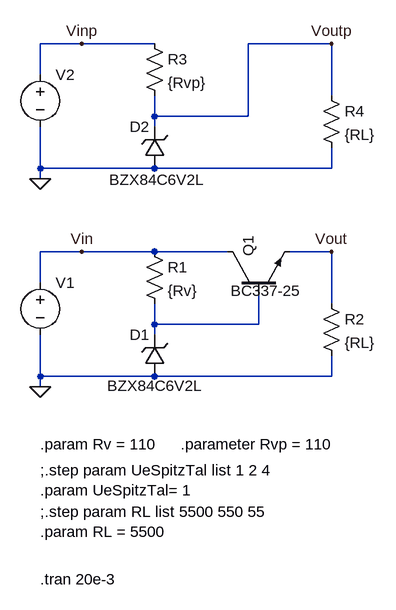
[diagram p0: schematic 400_SpgRegelung.asc]
400_SpgRegelung.asc, the LTspice schematic file:
Version 4.1
SHEET 1 968 680
WIRE 80 -304 16 -304
WIRE 192 -304 80 -304
WIRE 464 -304 336 -304
WIRE 16 -256 16 -304
WIRE 464 -224 464 -304
WIRE 192 -192 192 -224
WIRE 336 -192 336 -304
WIRE 336 -192 192 -192
WIRE 192 -176 192 -192
WIRE 16 -112 16 -176
WIRE 192 -112 16 -112
WIRE 464 -112 464 -144
WIRE 464 -112 192 -112
WIRE 16 -96 16 -112
WIRE 80 16 16 16
WIRE 192 16 80 16
WIRE 304 16 192 16
WIRE 464 16 400 16
WIRE 16 64 16 16
WIRE 464 96 464 16
WIRE 192 128 192 96
WIRE 352 128 352 80
WIRE 352 128 192 128
WIRE 192 144 192 128
WIRE 16 208 16 144
WIRE 192 208 16 208
WIRE 464 208 464 176
WIRE 464 208 192 208
WIRE 16 224 16 208
FLAG 16 224 0
FLAG 80 16 Vin
FLAG 464 16 Vout
FLAG 16 -96 0
FLAG 80 -304 Vinp
FLAG 464 -304 Voutp
SYMBOL voltage 16 48 R0
WINDOW 3 -42 -28 Invisible 2
WINDOW 123 0 0 Left 0
WINDOW 39 0 0 Left 0
SYMATTR Value SINE(12 {UeSpitzTal} 50)
SYMATTR InstName V1
SYMBOL res 176 0 R0
SYMATTR InstName R1
SYMATTR Value {Rv}
SYMBOL zener 208 208 R180
WINDOW 0 24 64 Left 2
WINDOW 3 -58 -14 Left 2
SYMATTR InstName D1
SYMATTR Value BZX84C6V2L
SYMATTR Description Diode
SYMATTR Type diode
SYMBOL npn 304 80 R270
WINDOW 3 4 5 VRight 2
SYMATTR InstName Q1
SYMATTR Value BC337-25
SYMBOL res 448 80 R0
SYMATTR InstName R2
SYMATTR Value {RL}
SYMBOL voltage 16 -272 R0
WINDOW 3 -42 -28 Invisible 2
WINDOW 123 0 0 Left 0
WINDOW 39 0 0 Left 0
SYMATTR Value SINE(12 {UeSpitzTal/2} 50)
SYMATTR InstName V2
SYMBOL res 176 -320 R0
SYMATTR InstName R3
SYMATTR Value {Rvp}
SYMBOL zener 208 -112 R180
WINDOW 0 24 64 Left 2
WINDOW 3 -61 -17 Left 2
SYMATTR InstName D2
SYMATTR Value BZX84C6V2L
SYMATTR Description Diode
SYMATTR Type diode
SYMBOL res 448 -240 R0
SYMATTR InstName R4
SYMATTR Value {RL}
TEXT 16 416 Left 2 !;.step param RL list 5500 550 55\n.param RL = 5500
TEXT 16 312 Left 2 !.param Rv = 110
TEXT 16 520 Left 2 !.tran 20e-3
TEXT 232 312 Left 2 !.parameter Rvp = 110
TEXT 16 352 Left 2 !;.step param UeSpitzTal list 1 2 4\n.param UeSpitzTal= 1

The netlist it stands for:
* 400_SpgRegelung.asc
V1 Vin 0 SINE(12 {UeSpitzTal} 50)
R1 Vin N001 {Rv}
D1 0 N001 BZX84C6V2L
Q1 Vin N001 Vout 0 BC337-25
R2 Vout 0 {RL}
V2 Vinp 0 SINE(12 {UeSpitzTal/2} 50)
R3 Vinp Voutp {Rvp}
D2 0 Voutp BZX84C6V2L
R4 Voutp 0 {RL}
.model D D
.lib standard.dio
.model NPN NPN
.model PNP PNP
.lib standard.bjt
;.step param RL list 5500 550 55
.param RL = 5500
.param Rv = 110
.tran 20e-3
.parameter Rvp = 110
;.step param UeSpitzTal list 1 2 4
.param UeSpitzTal= 1
.backanno
.end